# Altium schematic sheet AC Detection.SchDoc: AC Detection
size A4; DocumentNumber: 4; SheetNumber: 6; SheetTotal: 10
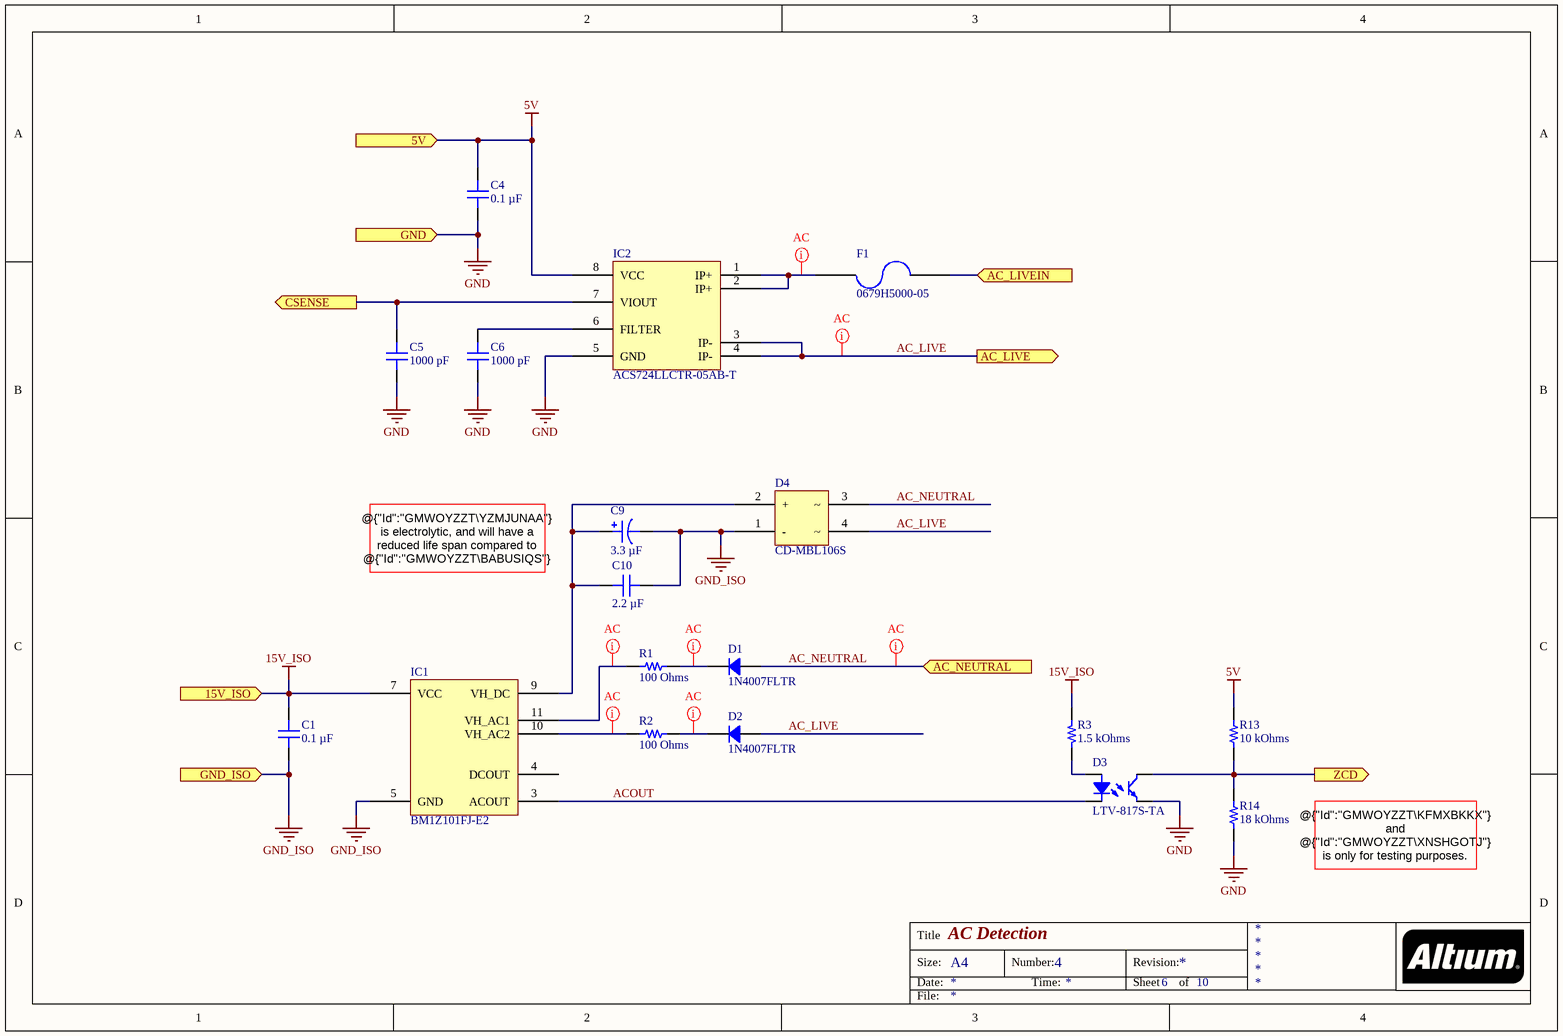
[diagram p0: AC Detection.SchDoc]

## Parts
C1  0.1 µF  [CAP 0603_1608]
C4  0.1 µF  [CAP 0603_1608]
C5  1000 pF  [CAP 0603_1608]
C6  1000 pF  [CAP 0603_1608]
C9  3.3 µF  [CAP ALSMD ELEC 8.3MM H11MM]
C10  2.2 µF  [CAP 2220_5650 3.0MM]
D1  1N4007FLTR  [SOD123F]
D2  1N4007FLTR  [SOD123F]
D3  LTV-817S-TA  [LITEON LTV-817]
D4  CD-MBL106S  [Bourns CD-MBL1xxS]
F1  0679H5000-05  [FUSE 2410_6125 2]
IC1  BM1Z101FJ-E2  [ROHM SOP-J11]
IC2  ACS724LLCTR-05AB-T  [ALLEGRO SOICN-8 LC]
R1  100 Ohms  [RES 1206_3216]
R2  100 Ohms  [RES 1206_3216]
R3  1.5 kOhms  [RES 0805_2012]
R13  10 kOhms  [RES 0603_1608]
R14  18 kOhms  [RES 0603_1608]

## Ports
5V (in, see Review[2A], AC DC Powersupply[3B], Connectors[3A], Opto[1B], SSR Control[1A], Supply 5V[2B], Supply 15V[2B]), 15V_ISO (in, see Review[2A], Supply 15V[3B]), AC_LIVE (out, see Review[2A], AC DC Powersupply[2B], SSR Control[3D], SSR[2B]), AC_LIVEIN (in, see Review[2A]), AC_NEUTRAL (in, see Review[2A], AC DC Powersupply[2B]), CSENSE (out, see Review[2A], Connectors[3C]), GND (in, see Review[2A], AC DC Powersupply[3B], Connectors[3D], Supply 5V[2C], Supply 15V[2C]), GND_ISO (in, see Review[2A], Supply 15V[3C]), ZCD (out, see Review[2A], Connectors[3D])

## Nets
5V: C4.2 IC2.8(VCC) R13.2 ; port 5V
15V_ISO: C1.2 IC1.7(VCC) R3.2 ; port 15V_ISO
GND: C4.1 C5.1 C6.1 D3.3 IC2.5(GND) R14.1 ; port GND
GND_ISO: C1.1 C9.2 C10.2 D4.1(-) IC1.5(GND) ; port GND_ISO
AC_LIVE: D2.1 D4.4 IC2.3(IP-) IC2.4(IP-) ; port AC_LIVE
AC_LIVEIN: F1.2 ; port AC_LIVEIN
AC_NEUTRAL: D1.1 D4.3 ; port AC_NEUTRAL
ACOUT: D3.2 IC1.3(ACOUT)
CSENSE: C5.2 IC2.7(VIOUT) ; port CSENSE
ZCD: D3.4 R13.1 R14.2 ; port ZCD
NetC6_2: C6.2 IC2.6(FILTER)
NetC9_1: C9.1 C10.1 D4.2(+) IC1.9(VH_DC)
NetD1_2: D1.2 R1.2
NetD2_2: D2.2 R2.2
NetD3_1: D3.1 R3.1
NetF1_1: F1.1 IC2.1(IP+) IC2.2(IP+)
NetIC1_10: IC1.10(VH_AC2) R2.1
NetIC1_11: IC1.11(VH_AC1) R1.1

Not connected (* = marked no-connect by the designer): IC1 4(DCOUT)

## Layout directives
net class AC: AC_LIVE, AC_NEUTRAL, NetD1_2, NetD2_2, NetF1_1, NetIC1_10, NetIC1_11

## Notes on the sheet
- @{"Id":"GMWOYZZT\YZMJUNAA"} is electrolytic, and will have a reduced life span compared to @{"Id":"GMWOYZZT\BABUSIQS"} which is ceramic. Choose one.
- @{"Id":"GMWOYZZT\KFMXBKKX"} and @{"Id":"GMWOYZZT\XNSHGOTJ"} is only for testing purposes. DNP/Remove if connected to control board.
- Title
- Size:
- Date:
- A4
- Number:
- Time:
- Revision:
- Sheet
- of
- File:

## Library data of the parts
C1 C4 = C0603C104K5RAC7411: CAP CER 0.1UF 50V X7R 0603; manufacturer: KEMET; Tolerance: ±10%; Part Number: C0603C104K5RAC7411; Value: 0.1 µF; Applications: Bypass, Decoupling; Capacitance: 0.1 µF; componentlink1description: Datasheet; componentlink1url: https://api.kemet.com/component-edge/download/datasheet/C0603C104K5RAC7411.pdf; componentlink2description: DigiKey Link; componentlink2url: https://www.digikey.com/en/products/detail/kemet/C0603C104K5RAC7411/3317013; Device Package: 0603 (1608 Metric); lastupdated: 5/3/2023 7:09:52 PM; Lifecycle Status: Active; Minimum Order: 1; Mounting Type: Surface Mount, MLCC; Operating Temperature: -55°C ~ 125°C; Package / Case: 0603 (1608 Metric); packaging: TapeAndReel; partid: 2233; Part Status: Active; price: 0.01; series: SMD Comm X7R; Size / Dimension: 0.063" L x 0.031" W (1.60mm x 0.80mm); Supplier 1: DigiKey; Supplier Part Number 1: 399-C0603C104K5RAC7411CT-ND; Temperature Coefficient: X7R; Thickness (Max): 0.035" (0.90mm); Voltage - Rated: 50V
C5 C6 = C0603X102K5RAC3316: CAP CER 0603 1NF 50V X7R 10%; manufacturer: KEMET; Part Number: C0603X102K5RAC3316; Value: 1000 pF; Applications: Automotive, Boardflex Sensitive; Capacitance: 1000 pF; componentlink1description: Datasheet; componentlink1url: https://api.kemet.com/component-edge/download/datasheet/C0603X102K5RAC3316.pdf; componentlink2description: DigiKey Link; componentlink2url: https://www.digikey.com/en/products/detail/kemet/C0603X102K5RAC3316/10315783; Device Package: 0603 (1608 Metric); Features: Soft Termination; lastupdated: 5/20/2023 7:10:23 PM; Lifecycle Status: Active; Minimum Order: 1; Mounting Type: Surface Mount, MLCC; Operating Temperature: -55°C ~ 125°C; Package / Case: 0603 (1608 Metric); packaging: TapeAndReel; partid: 16694; Part Status: Active; price: 0.06; Ratings: AEC-Q200; series: SMD Auto X7R VW80808; Size / Dimension: 0.063" L x 0.031" W (1.60mm x 0.80mm); Supplier 1: DigiKey; Supplier Part Number 1: 399-C0603X102K5RAC3316CT-ND; Temperature Coefficient: X7R; Thickness (Max): 0.037" (0.95mm); Tolerance: ±10%; Voltage - Rated: 50V
C9 = ULV2W3R3MNL1GS: CAP ALUM 3.3UF 20% 450V SMD; manufacturer: Nichicon; Lifetime @ Temp.: 10000 Hrs @ 105°C; Polarization: Polar; Ripple Current @ High Frequency: 40 mA @ 10 kHz; Ripple Current @ Low Frequency: 25 mA @ 120 Hz; Surface Mount Land Size: 0.327" L x 0.327" W (8.30mm x 8.30mm); Part Number: ULV2W3R3MNL1GS; Applications: General Purpose; Capacitance: 3.3 µF; componentlink1description: Datasheet; componentlink1url: http://nichicon-us.com/english/products/pdfs/e-ulv.pdf; componentlink2description: DigiKey Link; componentlink2url: https://www.digikey.com/en/products/detail/nichicon/ULV2W3R3MNL1GS/3664124; Device Package: Radial, Can - SMD; Height - Seated (Max): 0.433" (11.00mm); lastupdated: 15/09/2023 06:27:11; Lifecycle Status: Active; Minimum Order: 1; Mounting Type: Surface Mount; Operating Temperature: -40°C ~ 105°C; Package / Case: Radial, Can - SMD; packaging: TapeAndReel; partid: 28417; Part Status: Active; price: 0.32; series: ULV; Size / Dimension: 0.315" Dia (8.00mm); Supplier 1: DigiKey; Supplier Part Number 1: 493-6744-1-ND; Tolerance: ±20%; value: 3.3 µF; Voltage - Rated: 450 V
C10 = C5750X6S2W225K250KA: CAP CER 2.2UF 450V X6S 2220; manufacturer: TDK Corporation; Tolerance: ±10%; Part Number: C5750X6S2W225K250KA; Value: 2.2 µF; Applications: General Purpose; Capacitance: 2.2 µF; componentlink1description: Datasheet; componentlink1url: https://product.tdk.com/info/en/catalog/datasheets/mlcc_commercial_midvoltage_en.pdf?ref_disty=digikey; componentlink2description: DigiKey Link; componentlink2url: https://www.digikey.com/en/products/detail/tdk-corporation/C5750X6S2W225K250KA/2733216; Device Package: 2220 (5650 Metric); lastupdated: 16/10/2023 16:52:27; Lifecycle Status: Active; Minimum Order: 1; Mounting Type: Surface Mount, MLCC; Operating Temperature: -55°C ~ 105°C; Package / Case: 2220 (5650 Metric); packaging: TapeAndReel; Part Status: Active; price: 1.12; series: C; Size / Dimension: 0.224" L x 0.197" W (5.70mm x 5.00mm); Supplier 1: DigiKey; Supplier Part Number 1: 445-7781-1-ND; Temperature Coefficient: X6S; Thickness (Max): 0.110" (2.80mm); Voltage - Rated: 450V
D1 D2 = 1N4007FLTR: STANDARD RECTIFIER 1000V SOD-123; Manufacturer: SMC Diode Solutions; Capacitance @ Vr, F: 15pF @ 4V, 1MHz; Current - Average Rectified (Io): 1A; Current - Reverse Leakage @ Vr: 5µA @ 1000V; Speed: Standard Recovery >500ns, > 200mA (Io); Voltage - Forward (Vf) (Max) @ If: 1.1V @ 1A; Part Number: 1N4007FLTR; ComponentLink1Description: Datasheet; ComponentLink1URL: http://www.smc-diodes.com/propdf/1N4001FL-1N4007FL%20N1646%20REV.A.pdf; ComponentLink2Description: DigiKey Link; ComponentLink2URL: http://digikey.com/product-detail/en/smc-diode-solutions/1N4007FLTR/1655-1N4007FLCT-ND/11657827; Diode Type: Standard; LastUpdated: 8/30/2020 8:59:55 PM; Lifecycle Status: Active; Minimum Order: 1; Mounting Type: Surface Mount; Package / Case: SOD-123F; Packaging: TapeAndReel; PartId: 3314; Price: 0.01; Supplier 1: DigiKey; Supplier Part Number 1: 1655-1N4007FLCT-ND; Supplier Device Package: SOD-123FL; Voltage - DC Reverse (Vr) (Max): 1000V
D3 = LTV-817S-TA: OPTOISOLATR 5KV TRANSISTOR 4-SMD; Manufacturer: Lite-On Inc.; Current - DC Forward (If) (Max): 50mA; Current Transfer Ratio (Max): 600% @ 5mA; Current Transfer Ratio (Min): 50% @ 5mA; Input Type: DC; Number of Channels: 1; Rise / Fall Time (Typ): 4µs, 3µs; Vce Saturation (Max): 200mV; Voltage - Forward (Vf) (Typ): 1.2V; Voltage - Isolation: 5000Vrms; Voltage - Output (Max): 35V; Part Number: LTV-817S-TA; ComponentLink1Description: Datasheet; ComponentLink1URL: http://optoelectronics.liteon.com/upload/download/DS-70-96-0016/LTV-8X7%20series%20201610%20.pdf; ComponentLink2Description: DigiKey Link; ComponentLink2URL: http://digikey.com/product-detail/en/lite-on-inc/LTV-817S-TA/160-2038-1-ND/3711420; Current - Output / Channel: 50mA; Device Package: 4-SMD, Gull Wing; LastUpdated: 1/12/2020 9:59:02 PM; Lifecycle Status: Active; Minimum Order: 1; Mounting Type: Surface Mount; Operating Temperature: -30°C ~ 110°C; Output Type: Transistor; Package / Case: 4-SMD, Gull Wing; Packaging: TapeAndReel; Part Status: Active; Price: 0.12; Series: -; Supplier 1: DigiKey; Supplier Part Number 1: 160-2038-1-ND; Supplier Device Package: 4-SMD
D4 = CD-MBL106S: BRIDGE RECT 1PHASE 600V 1A; Manufacturer: Bourns Inc.; Current - Reverse Leakage @ Vr: 5 µA @ 600 V; Diode Type: Single Phase; Voltage - Forward (Vf) (Max) @ If: 1 V @ 1 A; ComponentLink1Description: Datasheet; ComponentLink1URL: https://www.bourns.com/docs/Product-Datasheets/cd-mbl1xxs.pdf; ComponentLink2Description: DigiKey Link; ComponentLink2URL: https://www.digikey.com/en/products/detail/bourns-inc/CD-MBL106S/7067520; Current - Average Rectified (Io): 1 A; Device Package: Chip, Concave Terminals; LastUpdated: 02/07/2023 12:12:09; Lifecycle Status: Active; Part Number: CD-MBL106S; Minimum Order: 1; Mounting Type: Surface Mount; Operating Temperature: -55°C ~ 175°C (TJ); Package / Case: Chip, Concave Terminals; Packaging: TapeAndReel; Part Status: Active; Price: 0.11; Series: -; Supplier 1: DigiKey; Supplier Part Number 1: CD-MBL106SCT-ND; Technology: Standard; Voltage - Peak Reverse (Max): 600 V
F1 = 0679H5000-05: FUSE BOARD MNT 5A 350VAC 60VDC; Manufacturer: Bel Fuse Inc.; Approval Agency: cURus; Breaking Capacity @ Rated Voltage: 50A AC, 150A DC; Fuse Type: Board Mount (Cartridge Style Excluded); Melting I²t: 5.5; Response Time: Fast Blow; Voltage Rating - AC: 350V; Voltage Rating - DC: 60V; Supplier 1: DigiKey; Supplier Part Number 1: 507-2054-1-ND; Part Number: 0679H5000-05; Approvals: cURus; ComponentLink1Description: Datasheet; ComponentLink1URL: https://www.belfuse.com/resources/CircuitProtection/datasheets/0679H%20Jan%202017.pdf; ComponentLink2Description: DigiKey Link; ComponentLink2URL: http://digikey.com/product-detail/en/bel-fuse-inc/0679H5000-05/507-2054-1-ND/6139818; Current Rating (Amps): 5A; LastUpdated: 5/31/2023 6:45:01 PM; Lifecycle Status: Active; Minimum Order: 1; Mounting Type: Surface Mount; Operating Temperature: -55°C ~ 125°C; Package / Case: 2-SMD, Square End Block; Packaging: TapeAndReel; Part Status: Active; Price: 0.14; Series: 0679H; Size / Dimension: 0.240" L x 0.100" W x 0.110" H (6.10mm x 2.54mm x 2.79mm)
IC1 = BM1Z101FJ-E2: IC SUPERVISOR 1 CHANNEL 11SOP; Manufacturer: Rohm Semiconductor; Number of Voltages Monitored: 1; Output: Open Drain or Open Collector; Part Number: BM1Z101FJ-E2; ComponentLink1Description: Datasheet; ComponentLink1URL: https://fscdn.rohm.com/en/products/databook/datasheet/ic/power/isolated_converter/bm1z101fj-e.pdf; ComponentLink2Description: DigiKey Link; ComponentLink2URL: https://www.digikey.com/en/products/detail/rohm-semiconductor/BM1Z101FJ-E2/13532560; LastUpdated: 5/17/2023 7:02:57 AM; Lifecycle Status: Active; Minimum Order: 1; Mounting Type: Surface Mount; Operating Temperature: -40°C ~ 105°C; Packaging: TapeAndReel; Part Status: Active; Price: 1.87; Series: -; Supplier 1: DigiKey; Supplier Part Number 1: 846-BM1Z101FJ-E2CT-ND; Supplier Device Package: 11-SOP-J; Type: Voltage Detector
IC2 = ACS724LLCTR-05AB-T: SENSOR CURRENT HALL 5A 8SOIC; Manufacturer: Allegro MicroSystems; Accuracy: ±0.6%; Current - Supply (Max): 14mA; For Measuring: AC/DC; Frequency: DC ~ 120kHz; Linearity: ±1.5%; Number of Channels: 1; Output: Ratiometric, Voltage; Polarization: Bidirectional; Response Time: 4µs; Sensitivity: 400mV/A; Sensor Type: Hall Effect, Open Loop; Voltage - Supply: 4.5V ~ 5.5V; Part Number: ACS724LLCTR-05AB-T; ComponentLink1Description: Datasheet; ComponentLink1URL: https://www.allegromicro.com/~/media/Files/Datasheets/ACS724-Datasheet.ashx; ComponentLink2Description: DigiKey Link; ComponentLink2URL: https://www.digikey.com/en/products/detail/allegro-microsystems/ACS724LLCTR-05AB-T/5400755; Current - Sensing: 5A; LastUpdated: 20/06/2023 21:01:40; Lifecycle Status: Active; Minimum Order: 1; Mounting Type: Surface Mount; Operating Temperature: -40°C ~ 150°C; Package / Case: 8-SOIC (0.154", 3.90mm Width); Packaging: TapeAndReel; Part Status: Active; Price: 2.03; Series: -; Supplier 1: DigiKey; Supplier Part Number 1: 620-ACS724LLCTR-05AB-TCT-ND; Supplier Device Package: 8-SOIC
R1 R2 = SR1206JR-7T100RL: RES 100 OHM 5% 3/4W 1206; Manufacturer: Yageo; Power (Watts): 0.75W, 3/4W; Temperature Coefficient: ±100ppm/°C; Part Number: SR1206JR-7T100RL; ComponentLink1Description: Datasheet; ComponentLink1URL: http://www.yageo.com/NewPortal/_en/search/productDocs.jsp?YageoPartNumber=SR1206JR-7T100RL; ComponentLink2Description: DigiKey Link; ComponentLink2URL: https://www.digikey.com/en/products/detail/yageo/SR1206JR-7T100RL/9696434; Composition: Thick Film; Device Package: 1206 (3216 Metric); Features: Automotive AEC-Q200, Pulse Withstanding; Height - Seated (Max): 0.026" (0.65mm); LastUpdated: 5/20/2023 7:45:17 PM; Lifecycle Status: Active; Minimum Order: 1; Number of Terminations: 2; Operating Temperature: -55°C ~ 155°C; Package / Case: 1206 (3216 Metric); Packaging: TapeAndReel; PartId: 27331; Part Status: Active; Price: 0.09; Ratings: AEC-Q200; Resistance: 100 Ohms; Series: SR; Size / Dimension: 0.122" L x 0.063" W (3.10mm x 1.60mm); Supplier 1: DigiKey; Supplier Part Number 1: YAG6196CT-ND; Supplier Device Package: 1206; Tolerance: ±5%; Value: 100 Ohms
R3 = CRGP0805F1K5: RES 1.5K OHM 1% 1/3W 0805; Manufacturer: TE Connectivity Passive Product; Power (Watts): 0.333W, 1/3W; Temperature Coefficient: ±100ppm/°C; Part Number: CRGP0805F1K5; Value: 1.5 kOhms; ComponentLink1Description: Datasheet; ComponentLink1URL: https://www.te.com/commerce/DocumentDelivery/DDEController?Action=srchrtrv&DocNm=9-1773463-9&DocType=DS&DocLang=English; ComponentLink2Description: DigiKey Link; ComponentLink2URL: https://www.digikey.com/en/products/detail/te-connectivity-passive-product/CRGP0805F1K5/8577081; Composition: Thick Film; Device Package: 0805 (2012 Metric); Features: Pulse Withstanding; Height - Seated (Max): 0.026" (0.65mm); LastUpdated: 5/21/2023 7:41:51 PM; Lifecycle Status: Active; Minimum Order: 1; Number of Terminations: 2; Operating Temperature: -55°C ~ 155°C; Package / Case: 0805 (2012 Metric); Packaging: TapeAndReel; PartId: 28723; Part Status: Active; Price: 0.02; Resistance: 1.5 kOhms; Series: CRGP; Size / Dimension: 0.079" L x 0.049" W (2.00mm x 1.25mm); Supplier 1: DigiKey; Supplier Part Number 1: A130479CT-ND; Supplier Device Package: 0805; Tolerance: ±1%
R13 = SG73S1JTTD1002F: RES 10K OHM 1% 1/5W 0603; Manufacturer: KOA Speer Electronics, Inc.; Power (Watts): 0.2W, 1/5W; Temperature Coefficient: ±100ppm/°C; Part Number: SG73S1JTTD1002F; Value: 10 kOhms; ComponentLink1Description: Datasheet; ComponentLink1URL: http://www.koaspeer.com/catimages/Products/SG73S/SG73S.pdf; ComponentLink2Description: DigiKey Link; ComponentLink2URL: https://www.digikey.com/en/products/detail/koa-speer-electronics-inc/SG73S1JTTD1002F/10279969; Composition: Thick Film; Device Package: 0603 (1608 Metric); Features: Automotive AEC-Q200, Moisture Resistant, Pulse Withstanding; Height - Seated (Max): 0.022" (0.55mm); LastUpdated: 6/13/2023 8:14:59 PM; Lifecycle Status: Active; Minimum Order: 1; Number of Terminations: 2; Operating Temperature: -55°C ~ 155°C; Package / Case: 0603 (1608 Metric); Packaging: TapeAndReel; PartId: 5386; Part Status: Active; Price: 0.01; Ratings: AEC-Q200; Resistance: 10 kOhms; Series: SG73S; Size / Dimension: 0.063" L x 0.031" W (1.60mm x 0.80mm); Supplier 1: DigiKey; Supplier Part Number 1: 2019-SG73S1JTTD1002FCT-ND; Supplier Device Package: 0603; Tolerance: ±1%
R14 = RC0603FR-1318KL: RES 18K OHM 1% 1/10W 0603; Manufacturer: Yageo; Power (Watts): 0.1W, 1/10W; Temperature Coefficient: ±100ppm/°C; Part Number: RC0603FR-1318KL; Value: 18 kOhms; ComponentLink1Description: Datasheet; ComponentLink1URL: https://www.yageo.com/upload/media/product/productsearch/datasheet/rchip/PYu-RC_Group_51_RoHS_L_11.pdf; ComponentLink2Description: DigiKey Link; ComponentLink2URL: https://www.digikey.com/en/products/detail/yageo/RC0603FR-1318KL/14286633; Composition: Thick Film; Device Package: 0603 (1608 Metric); Height - Seated (Max): 0.022" (0.55mm); LastUpdated: 15/10/2023 19:32:12; Lifecycle Status: Active; Minimum Order: 1; Number of Terminations: 2; Operating Temperature: -55°C ~ 155°C; Package / Case: 0603 (1608 Metric); Packaging: CutTape; PartId: 65513; Part Status: Active; Price: 0.01; Resistance: 18 kOhms; Series: RC_L; Size / Dimension: 0.063" L x 0.031" W (1.60mm x 0.80mm); Supplier 1: DigiKey; Supplier Part Number 1: 13-RC0603FR-1318KLCT-ND; Supplier Device Package: 0603; Tolerance: ±1%